# EAGLE schematic meinmidipedal (EAGLE 6.5.0)
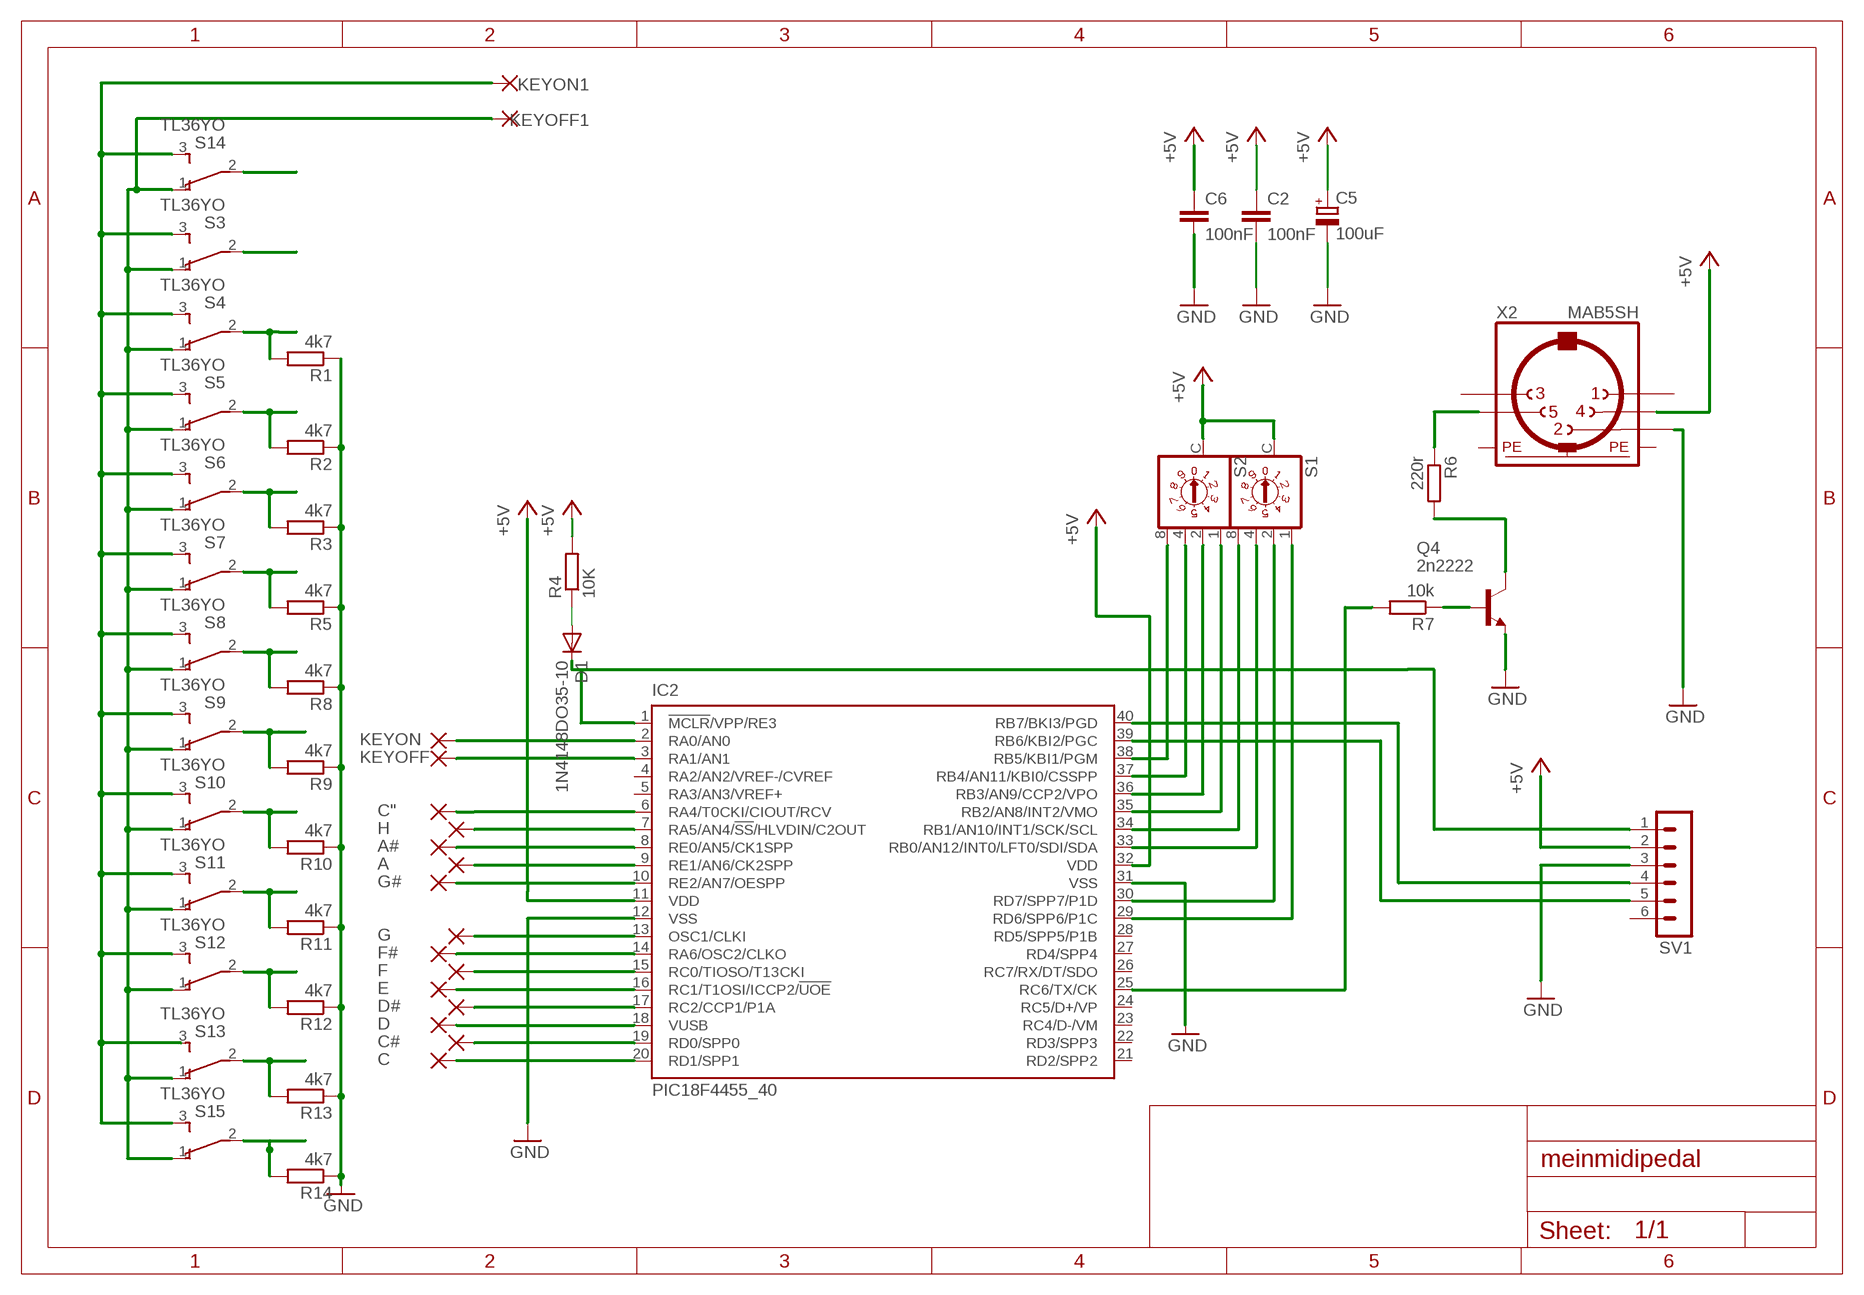
[diagram p0: schematic, sheet 1]

## Parts
A  2,54/0,8  [2,54/0,8]
A#  2,54/0,8  [2,54/0,8]
C  2,54/0,8  [2,54/0,8]
C2  100nF  C-EU025-025X050  [C025-025X050]
C5  100uF  CPOL-EUE15-9AXIAL  [E15-9]
C6  100nF  C-EU025-025X050  [C025-025X050]
C"  2,54/0,8  [2,54/0,8]
C#  2,54/0,8  [2,54/0,8]
D  2,54/0,8  [2,54/0,8]
D1  1N4148DO35-10  [DO35-10]
D#  2,54/0,8  [2,54/0,8]
E  2,54/0,8  [2,54/0,8]
F  2,54/0,8  [2,54/0,8]
F#  2,54/0,8  [2,54/0,8]
G  2,54/0,8  [2,54/0,8]
G#  2,54/0,8  [2,54/0,8]
H  2,54/0,8  [2,54/0,8]
IC2  PIC18F4455_40  [DIL40]
KEYOFF  2,54/0,8  [2,54/0,8]
KEYOFF1  2,54/0,8  [2,54/0,8]
KEYON  2,54/0,8  [2,54/0,8]
KEYON1  2,54/0,8  [2,54/0,8]
Q4  2n2222  BC547  [TO92]
R1  4k7  R-EU_0207/12  [0207/12]
R2  4k7  R-EU_0207/12  [0207/12]
R3  4k7  R-EU_0207/12  [0207/12]
R4  10K  R-EU_0207/12  [0207/12]
R5  4k7  R-EU_0207/12  [0207/12]
R6  220r  R-EU_0207/12  [0207/12]
R7  10k  R-EU_0207/12  [0207/12]
R8  4k7  R-EU_0207/12  [0207/12]
R9  4k7  R-EU_0207/12  [0207/12]
R10  4k7  R-EU_0207/12  [0207/12]
R11  4k7  R-EU_0207/12  [0207/12]
R12  4k7  R-EU_0207/12  [0207/12]
R13  4k7  R-EU_0207/12  [0207/12]
R14  4k7  R-EU_0207/12  [0207/12]
S1  P101  [P101]
S2  P101  [P101]
S3  TL36YO  [TL3XYO]
S4  TL36YO  [TL3XYO]
S5  TL36YO  [TL3XYO]
S6  TL36YO  [TL3XYO]
S7  TL36YO  [TL3XYO]
S8  TL36YO  [TL3XYO]
S9  TL36YO  [TL3XYO]
S10  TL36YO  [TL3XYO]
S11  TL36YO  [TL3XYO]
S12  TL36YO  [TL3XYO]
S13  TL36YO  [TL3XYO]
S14  TL36YO  [TL3XYO]
S15  TL36YO  [TL3XYO]
SV1  MA06-1  [MA06-1]
X2  MAB5SH  [MAB5SH]

## Nets
+5V: C2.1 C5.+ C6.1 IC2.11(VDD) IC2.32(VDD) R4.2 S1.C S2.C SV1.2 X2.4
GND: C2.2 C5.- IC2.12(VSS) IC2.31(VSS) R1.1 R2.1 R3.1 R5.1 R8.1 R9.1 R10.1 R11.1 R12.1 R13.1 R14.1 SV1.3 X2.2
N$1: KEYON1.1(P) S3.3(S) S4.3(S) S5.3(S) S6.3(S) S7.3(S) S8.3(S) S9.3(S) S10.3(S) S11.3(S) S12.3(S) S14.3(S) S15.3(S)
N$2: S14.2(P)
N$3: H.1(P) IC2.7(RA5/AN4/!SS!/HLVDIN/C2OUT)
N$4: D1.A R4.1
N$5: IC2.40(RB7/BKI3/PGD) SV1.4
N$6: IC2.38(RB5/KBI1/PGM) S2.8
N$7: IC2.25(RC6/TX/CK) R7.2
N$8: IC2.37(RB4/AN11/KBI0/CSSPP) S2.4
N$9: Q4.3(C) R6.2
N$10: KEYOFF1.1(P) S3.1(O) S4.1(O) S5.1(O) S6.1(O) S7.1(O) S8.1(O) S9.1(O) S10.1(O) S11.1(O) S12.1(O) S13.1(O) S14.1(O) S15.1(O)
N$11: C.1(P) IC2.20(RD1/SPP1)
N$12: Q4.2(B) R7.1
N$13: C#.1(P) IC2.19(RD0/SPP0)
N$14: D.1(P) IC2.18(VUSB)
N$15: R6.1 X2.5
N$16: D#.1(P) IC2.17(RC2/CCP1/P1A)
N$17: G#.1(P) IC2.10(RE2/AN7/OESPP)
N$18: E.1(P) IC2.16(RC1/T1OSI/ICCP2/!UOE)
N$19: F.1(P) IC2.15(RC0/TIOSO/T13CKI)
N$20: F#.1(P) IC2.14(RA6/OSC2/CLKO)
N$21: C".1(P) IC2.6(RA4/T0CKI/CIOUT/RCV)
N$22: A.1(P) IC2.9(RE1/AN6/CK2SPP)
N$23: A#.1(P) IC2.8(RE0/AN5/CK1SPP)
N$24: IC2.36(RB3/AN9/CCP2/VPO) S2.2
N$25: IC2.35(RB2/AN8/INT2/VMO) S2.1
N$27: R1.2 S4.2(P)
N$28: R2.2 S5.2(P)
N$29: G.1(P) IC2.13(OSC1/CLKI)
N$30: IC2.2(RA0/AN0) KEYON.1(P)
N$31: IC2.34(RB1/AN10/INT1/SCK/SCL) S1.8
N$32: IC2.33(RB0/AN12/INT0/LFT0/SDI/SDA) S1.4
N$33: IC2.3(RA1/AN1) KEYOFF.1(P)
N$34: IC2.30(RD7/SPP7/P1D) S1.2
N$35: IC2.29(RD6/SPP6/P1C) S1.1
N$36: D1.C IC2.1(!MCLR!/VPP/RE3) SV1.1
N$37: IC2.39(RB6/KBI2/PGC) SV1.5
N$38: R3.2 S6.2(P)
N$39: R5.2 S7.2(P)
N$40: R8.2 S8.2(P)
N$42: R10.2 S10.2(P)
N$43: R11.2 S11.2(P)
N$44: R12.2 S12.2(P)
N$45: R13.2 S13.2(P)
N$46: R14.2 S15.2(P)
N$48: R9.2 S9.2(P)
Unconnected: C6.2 IC2.4(RA2/AN2/VREF-/CVREF) IC2.5(RA3/AN3/VREF+) IC2.21(RD2/SPP2) IC2.22(RD3/SPP3) IC2.23(RC4/D-/VM) IC2.24(RC5/D+/VP) IC2.26(RC7/RX/DT/SDO) IC2.27(RD4/SPP4) IC2.28(RD5/SPP5/P1B) Q4.1(E) S3.2(P) S13.3(S) SV1.6 X2.1 X2.3

## Power pins joined to a net without a drawn wire
PE: X2.PE X2.PE@(PE)

## Library data of the parts
A A# C C" C# D D# E F F# G G# H KEYOFF KEYOFF1 KEYON KEYON1 = wirepad:2,54/0,8: THROUGH-HOLE PAD
C2 C6 = rcl:C-EU: CAPACITOR, European symbol
C5 = resistor:CPOL-EU: POLARIZED CAPACITOR, European symbol
D1 = diode:1N4148: DIODE high speed (Philips)
IC2 = microchip:PIC18F4*_40: USB Microcontrollers with nanoWatt Technology High-Performance, Enhanced Flash, 28/40/44-Pin, Source: http://ww1.microchip.com/downloads/en/devicedoc/39632c.pdf
Q4 = transistor-npn:BC547*: NPN Transistor
R1-R14 = resistor:R-EU_: RESISTOR, European symbol
S1 S2 = switch-dil:P101: DIL/CODE SWITCH
S3-S15 = switch:TL36YO: TINY SWITCH ON - ON Source: http://www2.produktinfo.conrad.com/datenblaetter/700000-724999/705152-da-01-de-Subminiaturschalter_TL_36YO.pdf
SV1 = con-lstb:MA06-1: PIN HEADER
X2 = con-hirschmann:MAB5SH: Female CONNECTOR 5 pins 90 deg. with shield, horizontal (DIN 41524)